# Altium project 门禁控制器V0.2.PrjPcb
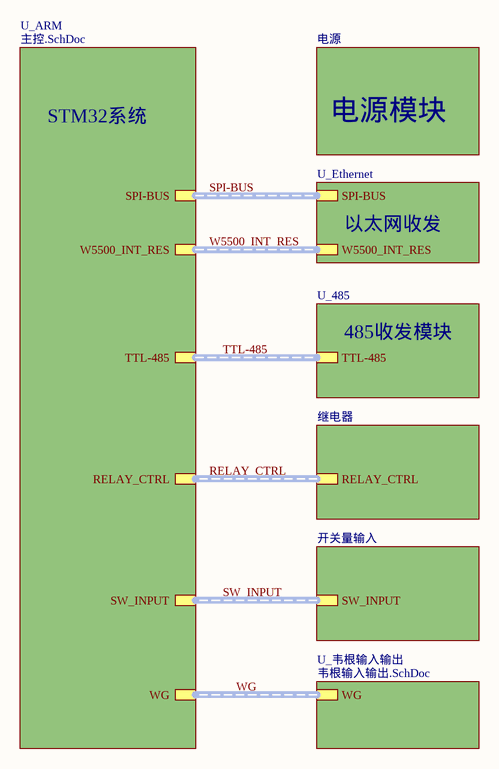
[diagram p0: 门禁控制器顶层设计.SchDoc]
8 sheets, 191 parts. Net scope: global (net labels, ports and power ports of the same name join across sheets).
Board file: 门禁控制器V0.2.PcbDoc
Sheets:
  门禁控制器顶层设计.SchDoc
    U_ARM = 主控.SchDoc
    U_485 = 485.SchDoc
    电源 = 电源.SchDoc
    U_Ethernet = TCP_IP.SchDoc
    继电器 = 继电器.SchDoc
    开关量输入 = 开关量输入.SchDoc
    U_韦根输入输出 = 韦根输入输出.SchDoc

## Sheet 门禁控制器顶层设计.SchDoc
size A4

### Sub-sheets
U_485 = 485.SchDoc: TTL-485 (harness TTL转485)
U_ARM = 主控.SchDoc: SPI-BUS (harness SPI总线), W5500_INT_RES (harness W5500_INT_RES), TTL-485 (harness TTL转485), RELAY_CTRL, SW_INPUT, WG
U_Ethernet = TCP_IP.SchDoc: SPI-BUS, W5500_INT_RES
U_韦根输入输出 = 韦根输入输出.SchDoc: WG (harness 韦根)
开关量输入 = 开关量输入.SchDoc: SW_INPUT (harness TTL转485)
电源 = 电源.SchDoc: no entries
继电器 = 继电器.SchDoc: RELAY_CTRL (harness TTL转485)

### Buses and harness runs
harness RELAY_CTRL = sheet U_ARM/RELAY_CTRL = sheet 继电器/RELAY_CTRL
harness SPI-BUS = sheet U_ARM/SPI-BUS = sheet U_Ethernet/SPI-BUS
harness SW_INPUT = sheet U_ARM/SW_INPUT = sheet 开关量输入/SW_INPUT
harness TTL-485 = sheet U_485/TTL-485 = sheet U_ARM/TTL-485
harness W5500_INT_RES = sheet U_ARM/W5500_INT_RES = sheet U_Ethernet/W5500_INT_RES
harness WG = sheet U_ARM/WG = sheet U_韦根输入输出/WG

### Notes on the sheet
- STM32系统
- 电源模块
- 以太网收发
- 485收发模块

## Sheet 主控.SchDoc
size A3
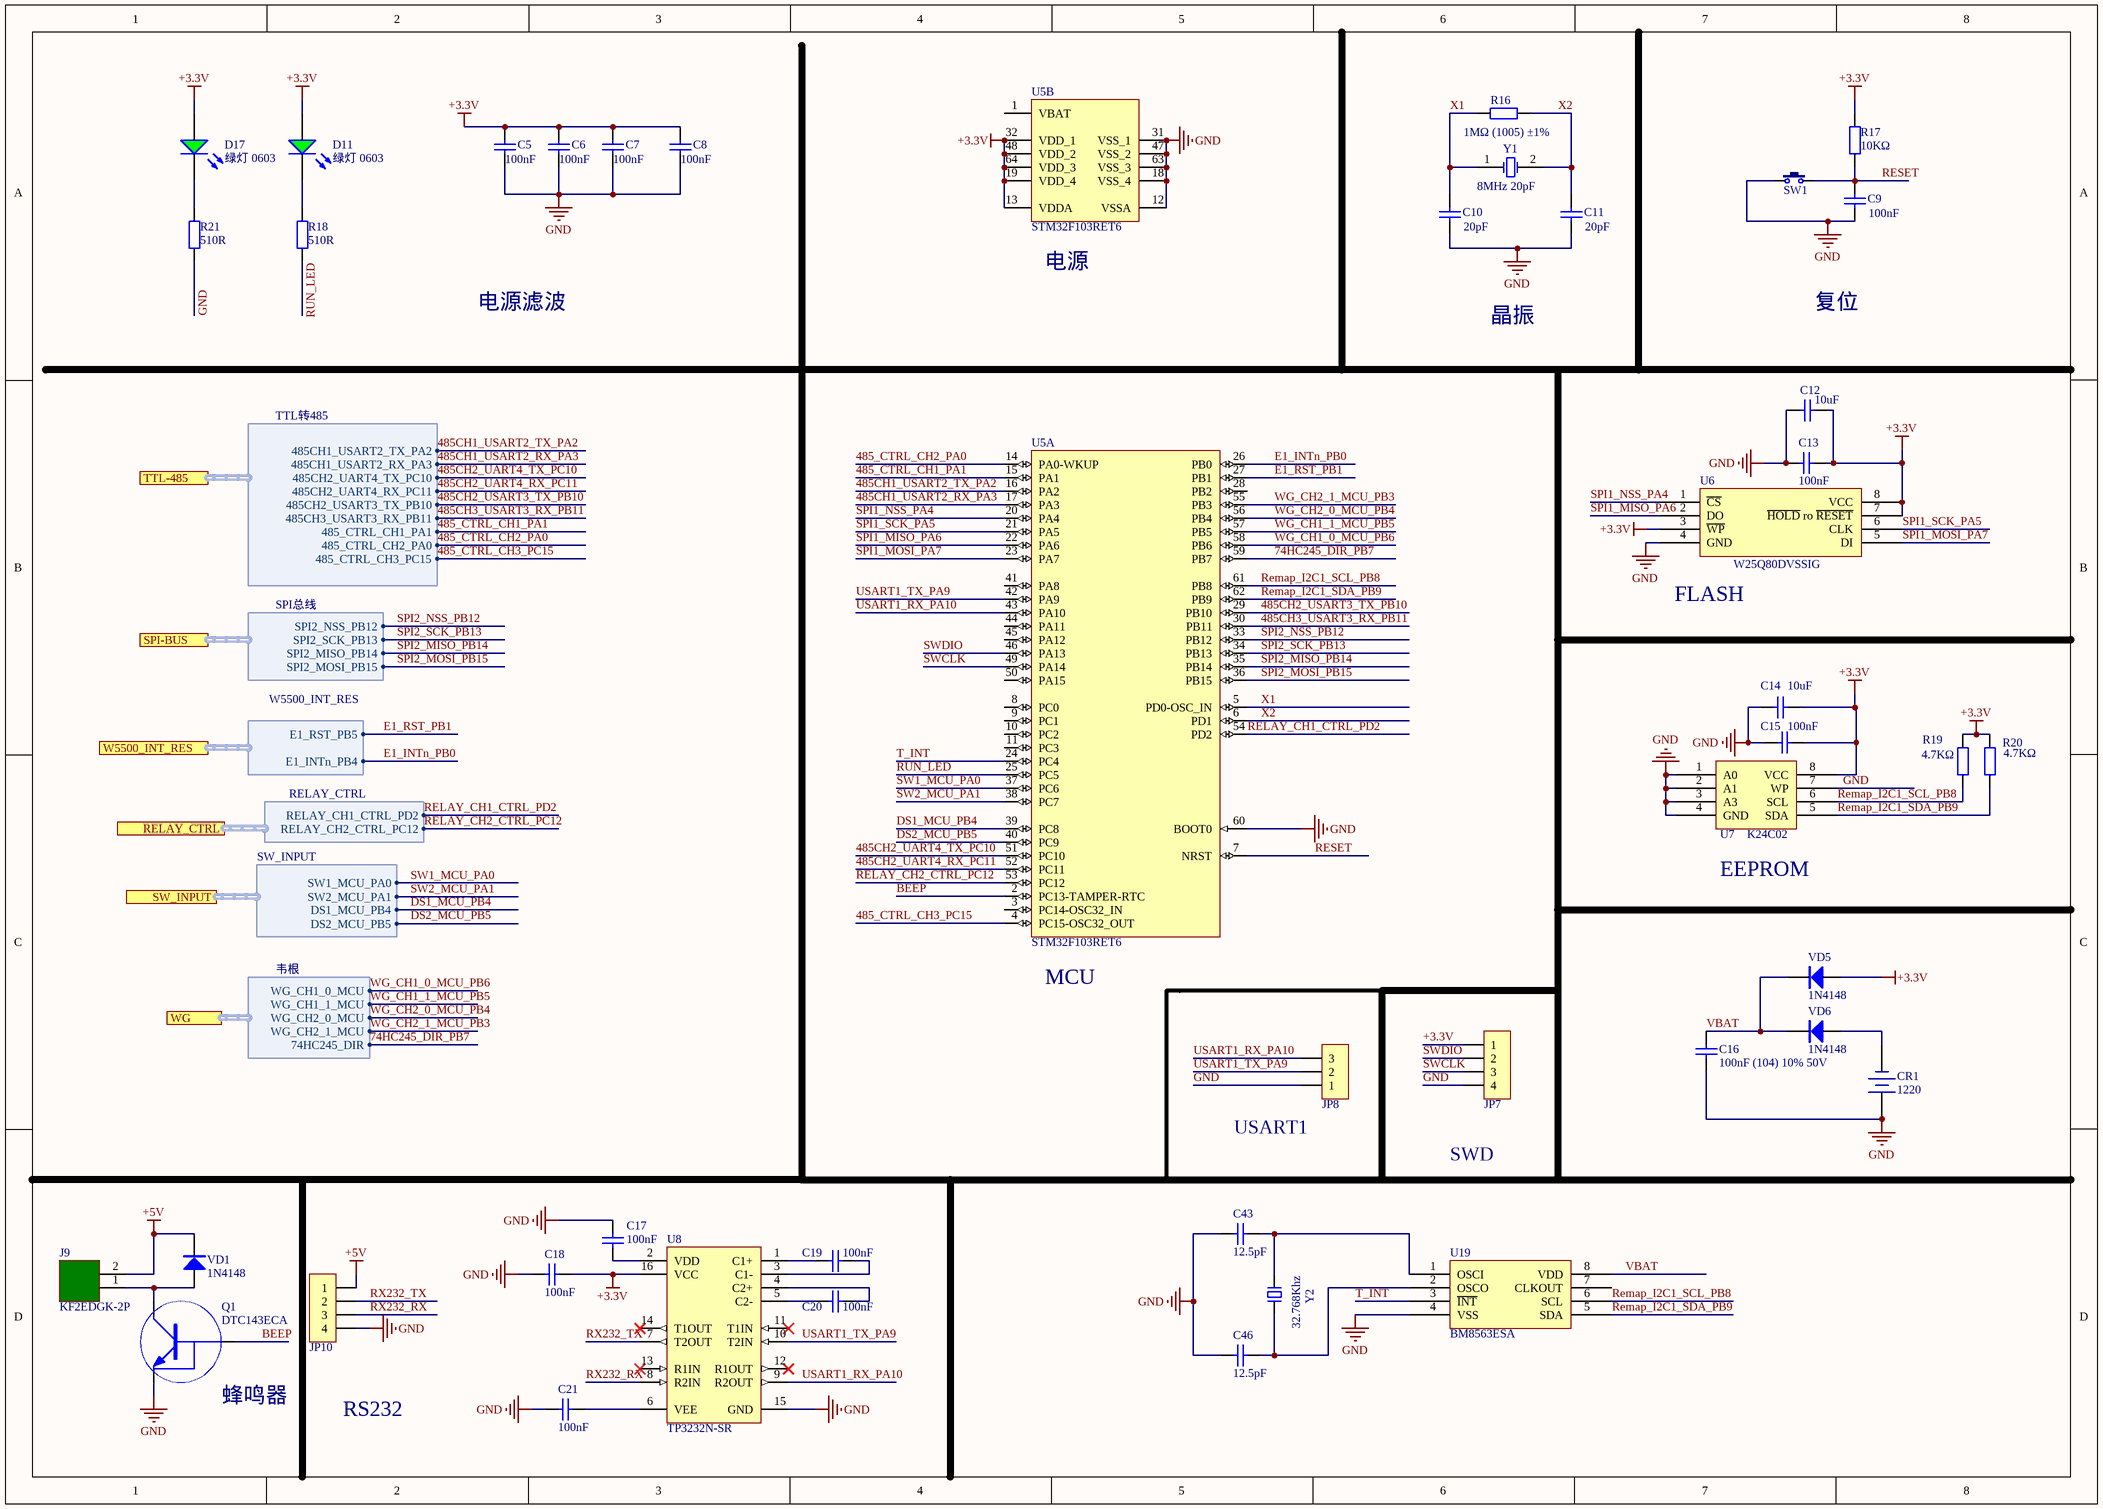
[diagram p1: 主控.SchDoc]

### Parts
C5  100nF  [0603_C]
C6  100nF  [0603_C]
C7  100nF  [0603_C]
C8  100nF  [0603_C]
C9  100nF  [0603_C]
C10  20pF  [0603_C]
C11  20pF  [0603_C]
C12  10uF  [0603_C]
C13  100nF  [0603_C]
C14  10uF  [0603_C]
C15  100nF  [0603_C]
C16  100nF (104) 10% 50V  [0603_C]
C17  100nF  [0603_C]
C18  100nF  [0603_C]
C19  100nF  [0603_C]
C20  100nF  [0603_C]
C21  100nF  [0603_C]
C43  12.5pF  [0603_C]
C46  12.5pF  [0603_C]
CR1  1220  [CR1220_A]
D11  绿灯 0603  [0603_LED_S1]
D17  绿灯 0603  [0603_LED_S1]
J9  KF2EDGK-2P  [KF2EDGK5.08W-2P]
JP7  HDR-1X4  [HDR-1X4_H]  (value not drawn)
JP8  HDR-1X3  [HDR-1X3_H]  (value not drawn)
JP10  HDR-1X4  [HDR-1X4]  (value not drawn)
Q1  DTC143ECA
R16  1MΩ (1005) ±1%  [0603_R]
R17  10KΩ  [0603_R]
R18  510R  [0603_R]
R19  4.7KΩ  [0603_R]
R20  4.7KΩ  [0603_R]
R21  510R  [0603_R]
SW1  3x6x5  [TSW SMD-3*6*4.3]  (value not drawn)
U5  STM32F103RET6  [LQFP-64_10x10x05P]  (parts A,B of 2)
U6  W25Q80DVSSIG  [SOIC-8_208mil]
U7  K24C02  [SOIC-8_150mil]
U8  TP3232N-SR  [SOIC-16_150mil]
U19  BM8563ESA  [SOIC-8_150mil]
VD1  1N4148  [MINI_MELF (LL34)]
VD5  1N4148  [MINI_MELF (LL34)]
VD6  1N4148  [MINI_MELF (LL34)]
Y1  8MHz 20pF  [XTAL-49S DIP]
Y2  32.768Khz  [XTAL-3215]

### Ports
RELAY_CTRL (harness RELAY_CTRL), SPI-BUS (harness SPI总线), SW_INPUT (harness SW_INPUT), TTL-485 (harness TTL转485), W5500_INT_RES (harness W5500_INT_RES), WG (harness 韦根)

### Harnesses
TTL转485: 485CH1_USART2_TX_PA2, 485CH1_USART2_RX_PA3, 485CH2_UART4_TX_PC10, 485CH2_UART4_RX_PC11, 485CH2_USART3_TX_PB10, 485CH3_USART3_RX_PB11, 485_CTRL_CH1_PA1, 485_CTRL_CH2_PA0, 485_CTRL_CH3_PC15
SPI总线: SPI2_NSS_PB12, SPI2_SCK_PB13, SPI2_MISO_PB14, SPI2_MOSI_PB15
W5500_INT_RES: E1_RST_PB5, E1_INTn_PB4
RELAY_CTRL: RELAY_CH1_CTRL_PD2, RELAY_CH2_CTRL_PC12
SW_INPUT: SW1_MCU_PA0, SW2_MCU_PA1, DS1_MCU_PB4, DS2_MCU_PB5
韦根: WG_CH1_0_MCU, WG_CH1_1_MCU, WG_CH2_1_MCU, 74HC245_DIR, WG_CH2_0_MCU

### Nets
+3.3V: C5.2 C6.2 C7.2 C8.2 C12.2 C13.1 C14.2 C15.1 C18.2 D11.A D17.A JP7.1 R17.1 R19.2 R20.2 U5.13(VDDA) U5.19(VDD_4) U5.32(VDD_1) U5.48(VDD_2) U5.64(VDD_3) U6.3(~{WP}) U6.7(~{HOLD}_ro_~{RESET}) U6.8(VCC) U7.8(VCC) U8.16(VCC) VD5.1(A)
+5V: J9.2 JP10.1 VD1.2(K)
GND: C5.1 C6.1 C7.1 C8.1 C9.1 C10.1 C11.1 C12.1 C13.2 C14.1 C15.2 C16.1 C17.2 C18.1 C21.1 C43.1 C46.1 CR1.1(DC+) JP7.4 JP8.1 JP10.4 Q1.2(GND) R21.1 SW1.1 U5.12(VSSA) U5.18(VSS_4) U5.31(VSS_1) U5.47(VSS_2) U5.60(BOOT0) U5.63(VSS_3) U6.4(GND) U7.1(A0) U7.2(A1) U7.3(A3) U7.4(GND) U7.7(WP) U8.15(GND) U19.4(VSS)
74HC245_DIR_PB7: U5.59(PB7) ; port WG.74HC245_DIR
485_CTRL_CH1_PA1: U5.15(PA1) ; port TTL-485.485_CTRL_CH1_PA1
485_CTRL_CH2_PA0: U5.14(PA0-WKUP) ; port TTL-485.485_CTRL_CH2_PA0
485_CTRL_CH3_PC15: U5.4(PC15-OSC32_OUT) ; port TTL-485.485_CTRL_CH3_PC15
485CH1_USART2_RX_PA3: U5.17(PA3) ; port TTL-485.485CH1_USART2_RX_PA3
485CH1_USART2_TX_PA2: U5.16(PA2) ; port TTL-485.485CH1_USART2_TX_PA2
485CH2_UART4_RX_PC11: U5.52(PC11) ; port TTL-485.485CH2_UART4_RX_PC11
485CH2_UART4_TX_PC10: U5.51(PC10) ; port TTL-485.485CH2_UART4_TX_PC10
485CH2_USART3_TX_PB10: U5.29(PB10) ; port TTL-485.485CH2_USART3_TX_PB10
485CH3_USART3_RX_PB11: U5.30(PB11) ; port TTL-485.485CH3_USART3_RX_PB11
BEEP: Q1.1(IN) U5.2(PC13-TAMPER-RTC)
DS1_MCU_PB4: U5.39(PC8) ; port SW_INPUT.DS1_MCU_PB4
DS2_MCU_PB5: U5.40(PC9) ; port SW_INPUT.DS2_MCU_PB5
E1_INTn_PB0: U5.26(PB0) ; port W5500_INT_RES.E1_INTn_PB4
E1_RST_PB1: U5.27(PB1) ; port W5500_INT_RES.E1_RST_PB5
RELAY_CH1_CTRL_PD2: U5.54(PD2) ; port RELAY_CTRL.RELAY_CH1_CTRL_PD2
RELAY_CH2_CTRL_PC12: U5.53(PC12) ; port RELAY_CTRL.RELAY_CH2_CTRL_PC12
Remap_I2C1_SCL_PB8: R19.1 U5.61(PB8) U7.6(SCL) U19.6(SCL)
Remap_I2C1_SDA_PB9: R20.1 U5.62(PB9) U7.5(SDA) U19.5(SDA)
RESET: C9.2 R17.2 SW1.2 U5.7(NRST)
RUN_LED: R18.1 U5.25(PC5)
RX232_RX: JP10.3 U8.8(R2IN)
RX232_TX: JP10.2 U8.7(T2OUT)
SPI1_MISO_PA6: U5.22(PA6) U6.2(DO)
SPI1_MOSI_PA7: U5.23(PA7) U6.5(DI)
SPI1_NSS_PA4: U5.20(PA4) U6.1(~{CS})
SPI1_SCK_PA5: U5.21(PA5) U6.6(CLK)
SPI2_MISO_PB14: U5.35(PB14) ; port SPI-BUS.SPI2_MISO_PB14
SPI2_MOSI_PB15: U5.36(PB15) ; port SPI-BUS.SPI2_MOSI_PB15
SPI2_NSS_PB12: U5.33(PB12) ; port SPI-BUS.SPI2_NSS_PB12
SPI2_SCK_PB13: U5.34(PB13) ; port SPI-BUS.SPI2_SCK_PB13
SW1_MCU_PA0: U5.37(PC6) ; port SW_INPUT.SW1_MCU_PA0
SW2_MCU_PA1: U5.38(PC7) ; port SW_INPUT.SW2_MCU_PA1
SWCLK: JP7.3 U5.49(PA14)
SWDIO: JP7.2 U5.46(PA13)
T_INT: U5.24(PC4) U19.3(~{INT})
USART1_RX_PA10: JP8.3 U5.43(PA10) U8.9(R2OUT)
USART1_TX_PA9: JP8.2 U5.42(PA9) U8.10(T2IN)
VBAT: C16.2 U19.8(VDD) VD5.2(K) VD6.2(K)
WG_CH1_0_MCU_PB6: U5.58(PB6) ; port WG.WG_CH1_0_MCU
WG_CH1_1_MCU_PB5: U5.57(PB5) ; port WG.WG_CH1_1_MCU
WG_CH2_0_MCU_PB4: U5.56(PB4) ; port WG.WG_CH2_0_MCU
WG_CH2_1_MCU_PB3: U5.55(PB3) ; port WG.WG_CH2_1_MCU
X1: C10.2 R16.1 U5.5(PD0-OSC_IN) Y1.1(OSC1)
X2: C11.2 R16.2 U5.6(PD1) Y1.2(OSC2)
NetC17_1: C17.1 U8.2(VDD)
NetC19_1: C19.1 U8.1(C1+)
NetC19_2: C19.2 U8.3(C1-)
NetC20_1: C20.1 U8.5(C2-)
NetC20_2: C20.2 U8.4(C2+)
NetC21_2: C21.2 U8.6(VEE)
NetC43_2: C43.2 U19.1(OSCI) Y2.1
NetC46_2: C46.2 U19.2(OSCO) Y2.2
NetCR1_2: CR1.2(DC-) VD6.1(A)
NetD11_K: D11.K R18.2
NetD17_K: D17.K R21.2
NetJ9_1: J9.1 Q1.3(OUT) VD1.1(A)

Not connected (* = marked no-connect by the designer): U5 1(VBAT) 3(PC14-OSC32_IN) 8(PC0) 9(PC1) 10(PC2) 11(PC3) 28(PB2) 41(PA8) 44(PA11) 45(PA12) 50(PA15); U8 11(T1IN)* 12(R1OUT)* 13(R1IN)* 14(T1OUT)*; U19 7(CLKOUT)

### Notes on the sheet
- 电源滤波
- (near U5) 电源
- 复位
- 晶振
- (near U6) FLASH
- (near U7) EEPROM
- (near U5) MCU
- (near JP8) USART1
- SWD
- (near Q1) 蜂鸣器
- RS232
- Labels drawn without touching a wire or pin: DS2_MCU_PB5, SW1_MCU_PA0

### Library data of the parts
C5-C9 C13 C15-C21 = 0603 100nF (104) 10% 50V: 贴片电容; ComponentLink1Description: 供应商链接; ComponentLink1URL: http://www.szlcsc.com/product/details_15331.html; Package: 0603; Supplier: LC; SuppliersPartNumber: C14663
C10 C11 = 0603 6pF (6R0) 0.25pF 50V: 贴片电容; ComponentLink1Description: 供应商链接; ComponentLink1URL: http://www.szlcsc.com/product/details_38453.html; Package: 0603; Supplier: LC; SuppliersPartNumber: C37474
C12 C14 = 0603 10uF (106) 10% 10V: 贴片电容; ComponentLink1Description: 供应商链接; ComponentLink1URL: http://www.szlcsc.com/product/details_20411.html; Package: 0603; Supplier: LC; SuppliersPartNumber: C19702
C43 C46 = 0603 12pF (120) 5% 50V: 贴片电容; ComponentLink1Description: 供应商链接; ComponentLink1URL: http://www.szlcsc.com/product/details_39506.html; Package: 0603; Supplier: LC; SuppliersPartNumber: C38523
CR1 = CR-3V: 微型电池; 版权归属: 源创客; BOM名称: 微型电池; 学习资源: www.ooocke.com
D11 D17 = 0603 绿灯: 发光二极管; ComponentLink1Description: 供应商链接; ComponentLink1URL: http://www.szlcsc.com/product/details_73152.html; Package: 0603; Supplier: LC; SuppliersPartNumber: C72043
JP7 JP10 = Header 4: 4P接插件; 版权归属: 源创客; BOM名称: 4P接插件; 学习资源: www.ooocke.com
JP8 = Header 3: 3P接插件; 版权归属: 源创客; BOM名称: 3P接插件; 学习资源: www.ooocke.com
Q1 = DTC143ECA: NPN集成三极管; ComponentLink1Description: 供应商; ComponentLink1URL: https://item.szlcsc.com/14526.html
R16 = 0603 10MΩ (1005) 1%: 贴片电阻; ComponentLink1Description: 供应商链接; ComponentLink1URL: http://www.szlcsc.com/product/details_7726.html; Package: 0603; Supplier: LC; SuppliersPartNumber: C7250
R17 = 0603 10KΩ (1002) 1%: 贴片电阻; ComponentLink1Description: 供应商链接; ComponentLink1URL: http://www.szlcsc.com/product/details_26547.html; Package: 0603; Supplier: LC; SuppliersPartNumber: C25804
R18 R21 = 0603 2KΩ (2001) 1%: 贴片电阻; ComponentLink1Description: 供应商链接; ComponentLink1URL: http://www.szlcsc.com/product/details_23702.html; Package: 0603; Supplier: LC; SuppliersPartNumber: C22975
R19 R20 = 0603 4.7KΩ (4701) 1%: 贴片电阻; ComponentLink1Description: 供应商链接; ComponentLink1URL: http://www.szlcsc.com/product/details_23889.html; Package: 0603; Supplier: LC; SuppliersPartNumber: C23162
SW1 = TSW 3x6: 3x6轻触开关; 版权归属: 源创客; BOM名称: 3x6轻触开关; 学习资源: www.ooocke.com
U5 = STM32F103RET6: ARM; ComponentLink1Description: 供应商链接; ComponentLink1URL: http://www.szlcsc.com/product/details_8814.html; Package: LQFP-64_10x10x05P; Supplier: LC; SuppliersPartNumber: C8322
U6 = W25Q128FVSIG: Flash ROM; ComponentLink1Description: 供应商链接; ComponentLink1URL: http://www.szlcsc.com/product/details_36072.html; Package: SOIC-8; Supplier: LC; SuppliersPartNumber: C35101; ComponentLink2Description: 华邦; ComponentLink2URL: https://item.szlcsc.com/14743.html
U7 = EEPROM/AT24C256C-SSHL-T: EEPROM; ComponentLink1Description: 供应商链接; ComponentLink1URL: http://www.szlcsc.com/product/details_6947.html; Package: SOIC-8_150mil; Supplier: LC; SuppliersPartNumber: C6482; ComponentLink2Description: 华虹宏力; ComponentLink2URL: https://item.szlcsc.com/84948.html
U8 = MAX232ESE: RS232; ComponentLink1Description: 供应商链接; ComponentLink1URL: http://www.szlcsc.com/product/details_27608.html; Package: SOIC-16_150mil; Supplier: LC; SuppliersPartNumber: C26860
U19 = PCF8563T/5,518: 实时时钟; ComponentLink1Description: 供应商链接; ComponentLink1URL: http://www.szlcsc.com/product/details_7917.html; Package: SOIC-8_150mil; Supplier: LC; SuppliersPartNumber: C7440; ComponentLink2Description: BL(上海贝岭); ComponentLink2URL: https://item.szlcsc.com/142290.html
VD1 VD5 VD6 = 1N4148: 高速开关二极管; 版权归属: 源创客; BOM名称: 高速开关二极管; 学习资源: www.ooocke.com
Y1 = SMD-5032_2P 8MHz 20ppm 20pF: 贴片晶振; ComponentLink1Description: 供应商链接; ComponentLink1URL: http://www.szlcsc.com/product/details_19261.html; Package: SMD-5032_2P; Supplier: LC; SuppliersPartNumber: C18560
Y2 = XTAL-2: 2脚晶振; 版权归属: 源创客; BOM名称: 2脚晶振; 学习资源: www.ooocke.com

## Sheet 485.SchDoc
size A3
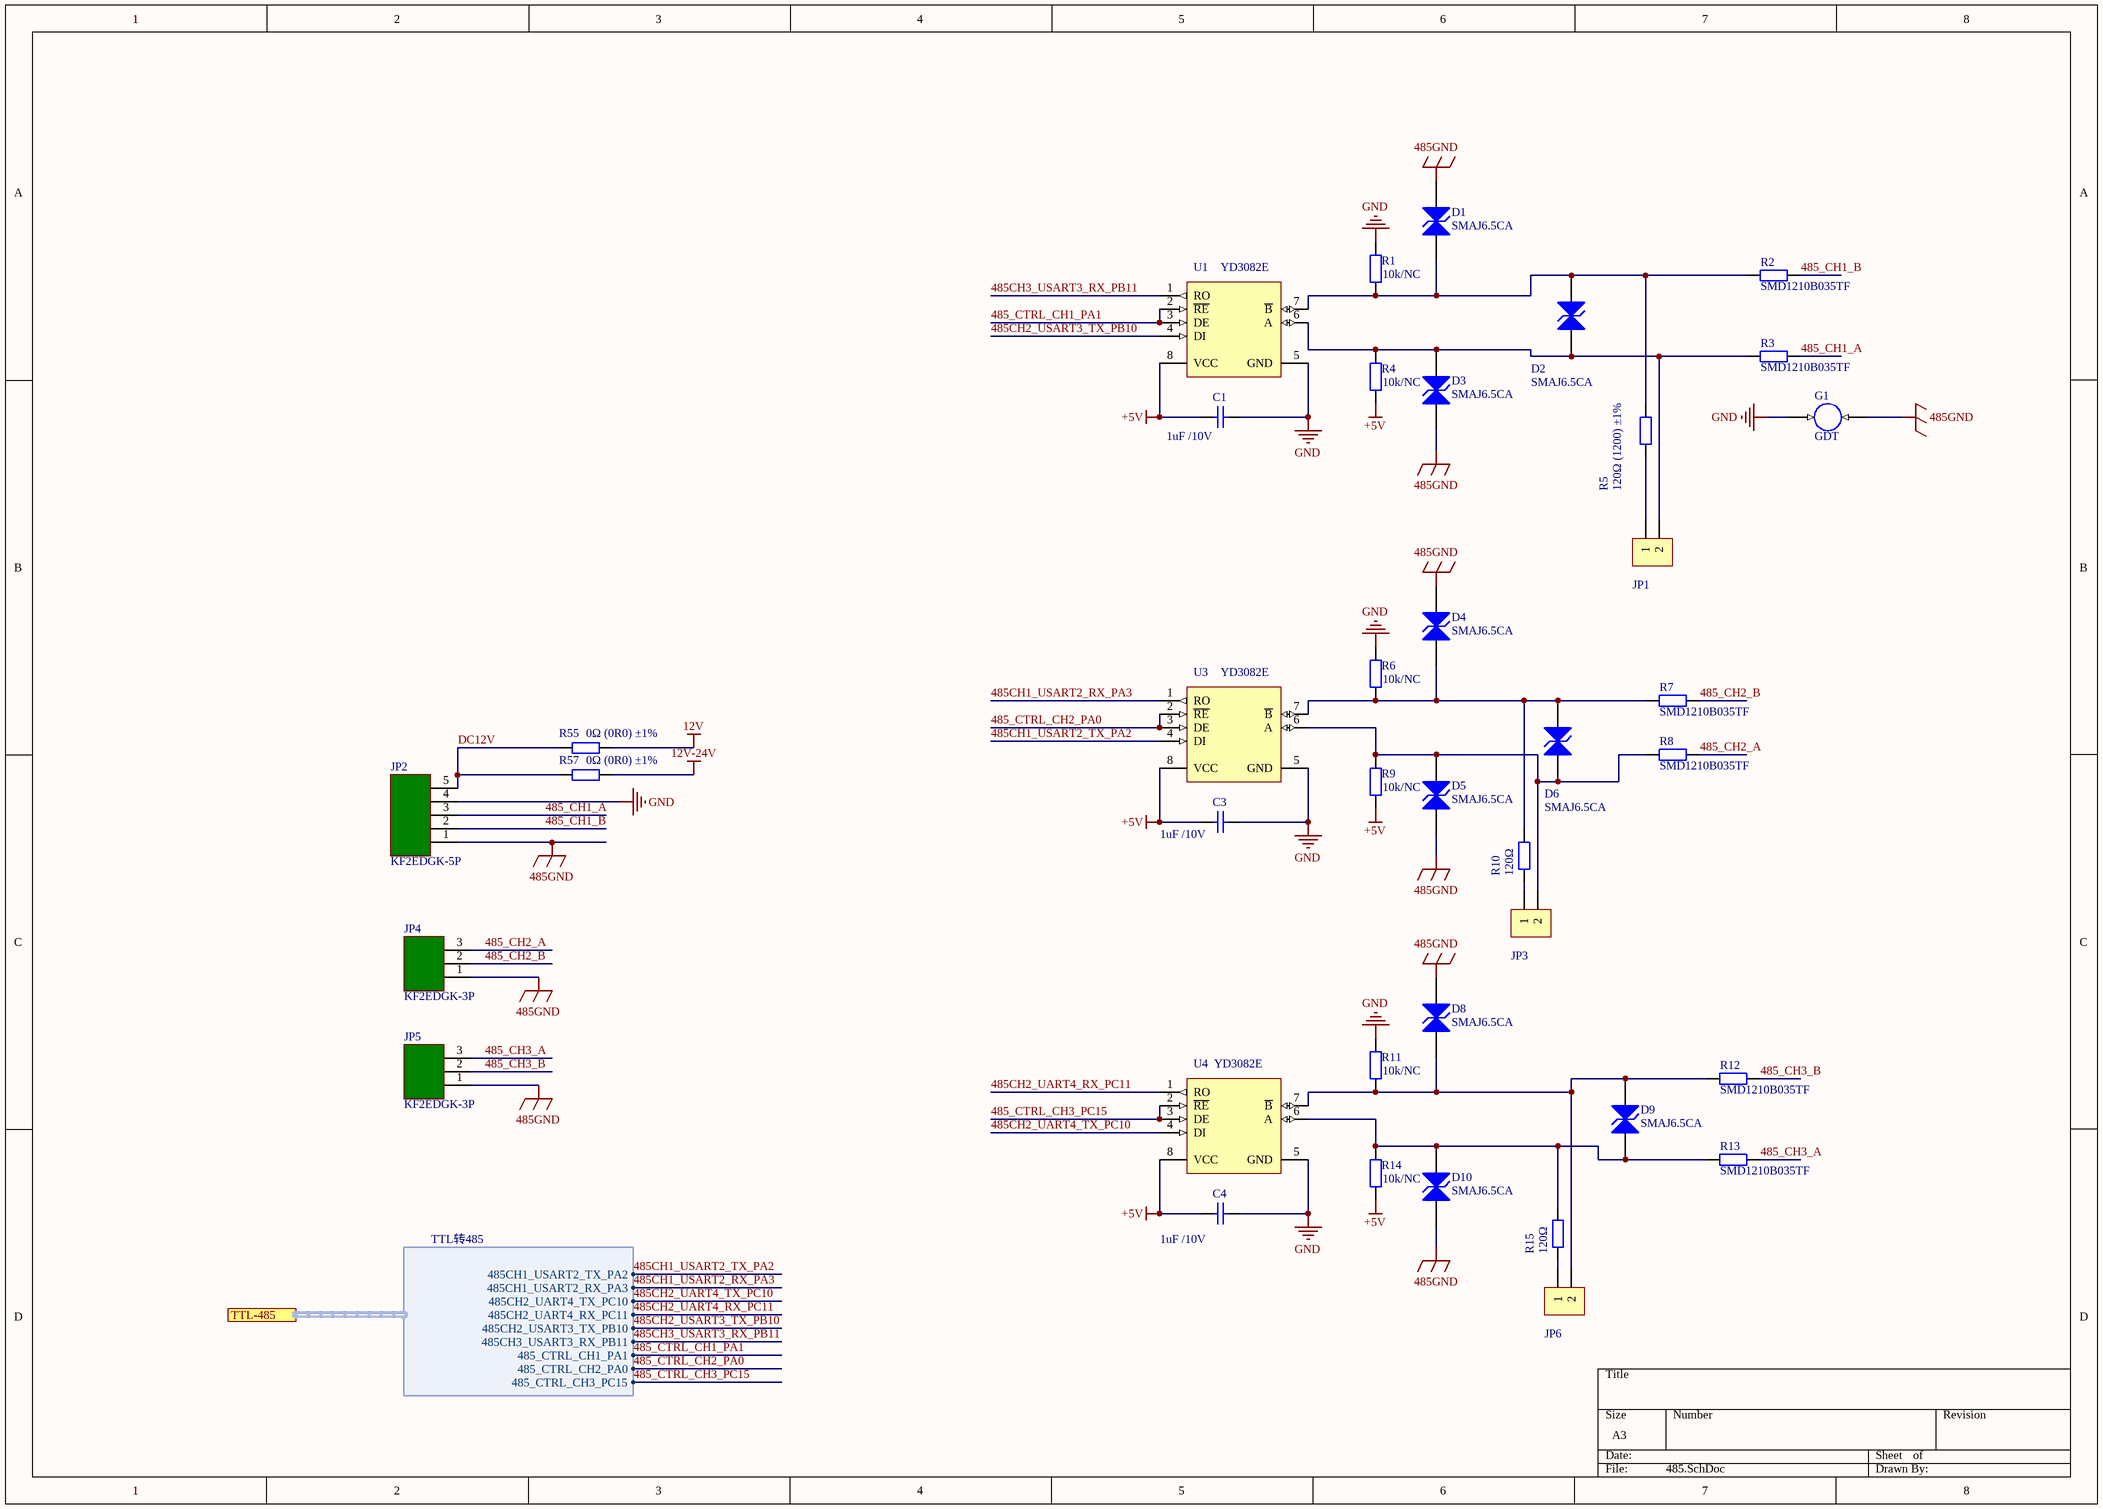
[diagram p2: 485.SchDoc]

### Parts
C1  1uF /10V  [0603_C]
C3  1uF /10V  [0603_C]
C4  1uF /10V  [0603_C]
D1  SMAJ6.5CA  [SMA(DO-214AC)_S1]
D2  SMAJ6.5CA  [SMA(DO-214AC)_S1]
D3  SMAJ6.5CA  [SMA(DO-214AC)_S1]
D4  SMAJ6.5CA  [SMA(DO-214AC)_S1]
D5  SMAJ6.5CA  [SMA(DO-214AC)_S1]
D6  SMAJ6.5CA  [SMA(DO-214AC)_S1]
D8  SMAJ6.5CA  [SMA(DO-214AC)_S1]
D9  SMAJ6.5CA  [SMA(DO-214AC)_S1]
D10  SMAJ6.5CA  [SMA(DO-214AC)_S1]
G1  GDT  [GDT]
JP1  HDR-1X2  [HDR-1X2]  (value not drawn)
JP2  KF2EDGK-5P  [KF2EDGK5.08W-5P]
JP3  HDR-1X2  [HDR-1X2]  (value not drawn)
JP4  KF2EDGK-3P  [KF2EDGK5.08W-3P]
JP5  KF2EDGK-3P  [KF2EDGK5.08W-3P]
JP6  HDR-1X2  [HDR-1X2]  (value not drawn)
R1  10k/NC  [0603_R]
R2  SMD1210B035TF  [1206_R]
R3  SMD1210B035TF  [1206_R]
R4  10k/NC  [0603_R]
R5  120Ω (1200) ±1%  [0603_R]
R6  10k/NC  [0603_R]
R7  SMD1210B035TF  [1206_R]
R8  SMD1210B035TF  [1206_R]
R9  10k/NC  [0603_R]
R10  120Ω  [0603_R]
R11  10k/NC  [0603_R]
R12  SMD1210B035TF  [1206_R]
R13  SMD1210B035TF  [1206_R]
R14  10k/NC  [0603_R]
R15  120Ω  [0603_R]
R55  0Ω (0R0) ±1%  [1206_R]
R57  0Ω (0R0) ±1%  [1206_R]
U1  YD3082E  [SOIC-8_150mil]
U3  YD3082E  [SOIC-8_150mil]
U4  YD3082E  [SOIC-8_150mil]

### Ports
TTL-485 (harness TTL转485)

### Harnesses
TTL转485: 485CH1_USART2_TX_PA2, 485CH1_USART2_RX_PA3, 485CH2_UART4_TX_PC10, 485CH2_UART4_RX_PC11, 485CH2_USART3_TX_PB10, 485CH3_USART3_RX_PB11, 485_CTRL_CH1_PA1, 485_CTRL_CH2_PA0, 485_CTRL_CH3_PC15

### Nets
12V: R55.1
12V-24V: R57.1
485GND: D1.1(A) D3.1(A) D4.1(A) D5.1(A) D8.1(A) D10.1(A) G1.1 JP2.1 JP4.1 JP5.1
+5V: C1.1 C3.1 C4.1 R4.1 R9.1 R14.1 U1.8(VCC) U3.8(VCC) U4.8(VCC)
GND: C1.2 C3.2 C4.2 G1.2 JP2.4 R1.2 R6.2 R11.2 U1.5(GND) U3.5(GND) U4.5(GND)
485_CH1_A: JP2.3 R3.2
485_CH1_B: JP2.2 R2.2
485_CH2_A: JP4.3 R8.2
485_CH2_B: JP4.2 R7.2
485_CH3_A: JP5.3 R13.2
485_CH3_B: JP5.2 R12.2
485_CTRL_CH1_PA1: U1.2(~{RE}) U1.3(DE) ; port TTL-485.485_CTRL_CH1_PA1
485_CTRL_CH2_PA0: U3.2(~{RE}) U3.3(DE) ; port TTL-485.485_CTRL_CH2_PA0
485_CTRL_CH3_PC15: U4.2(~{RE}) U4.3(DE) ; port TTL-485.485_CTRL_CH3_PC15
485CH1_USART2_RX_PA3: U3.1(RO) ; port TTL-485.485CH1_USART2_RX_PA3
485CH1_USART2_TX_PA2: U3.4(DI) ; port TTL-485.485CH1_USART2_TX_PA2
485CH2_UART4_RX_PC11: U4.1(RO) ; port TTL-485.485CH2_UART4_RX_PC11
485CH2_UART4_TX_PC10: U4.4(DI) ; port TTL-485.485CH2_UART4_TX_PC10
485CH2_USART3_TX_PB10: U1.4(DI) ; port TTL-485.485CH2_USART3_TX_PB10
485CH3_USART3_RX_PB11: U1.1(RO) ; port TTL-485.485CH3_USART3_RX_PB11
DC12V: JP2.5 R55.2 R57.2
NetD1_2: D1.2(K) D2.1(A) R1.1 R2.1 R5.1 U1.7(~{B})
NetD2_2: D2.2(K) D3.2(K) JP1.2 R3.1 R4.2 U1.6(A)
NetD4_2: D4.2(K) D6.1(A) R6.1 R7.1 R10.2 U3.7(~{B})
NetD5_2: D5.2(K) D6.2(K) JP3.2 R8.1 R9.2 U3.6(A)
NetD8_2: D8.2(K) D9.1(A) JP6.2 R11.1 R12.1 U4.7(~{B})
NetD9_2: D9.2(K) D10.2(K) R13.1 R14.2 R15.2 U4.6(A)
NetJP1_1: JP1.1 R5.2
NetJP3_1: JP3.1 R10.1
NetJP6_1: JP6.1 R15.1

### Library data of the parts
C1 C3 C4 = 0603 100nF (104) 10% 50V: 贴片电容; ComponentLink1Description: 供应商链接; ComponentLink1URL: http://www.szlcsc.com/product/details_15331.html; Package: 0603; Supplier: LC; SuppliersPartNumber: C14663
D1-D6 D8-D10 = SMB/DO-214AA P6SMB6.8CA: TVS; ComponentLink1Description: 供应商链接; ComponentLink1URL: http://www.szlcsc.com/product/details_79530.html; Package: SMB/DO-214AA; Supplier: LC; SuppliersPartNumber: C78395
G1 = GDT: 放电管
JP1 JP3 JP6 = Header 2: 2P接插件; 版权归属: 源创客; BOM名称: 2P接插件; 学习资源: www.ooocke.com
R1 R4 R6 R9 R11 R14 = 0603 3.3KΩ (3301) 1%: 贴片电阻; ComponentLink1Description: 供应商链接; ComponentLink1URL: http://www.szlcsc.com/product/details_23705.html; Package: 0603; Supplier: LC; SuppliersPartNumber: C22978
R2 R3 R7 R8 R12 R13 R55 R57 = 1206 0Ω (0R0) 1%: 贴片电阻; ComponentLink1Description: 供应商链接; ComponentLink1URL: http://www.szlcsc.com/product/details_18576.html; Package: 1206; Supplier: LC; SuppliersPartNumber: C17888
R5 R10 R15 = 0603 120Ω (1200) 1%: 贴片电阻; ComponentLink1Description: 供应商链接; ComponentLink1URL: http://www.szlcsc.com/product/details_23514.html; Package: 0603; Supplier: LC; SuppliersPartNumber: C22787
U1 U3 U4 = SP485EEN-L/TR: RS-485/RS-422; ComponentLink1Description: 供应商链接; ComponentLink1URL: http://www.szlcsc.com/product/details_7327.html; Package: SOIC-8; Supplier: LC; SuppliersPartNumber: C6855

## Sheet 电源.SchDoc
size A4
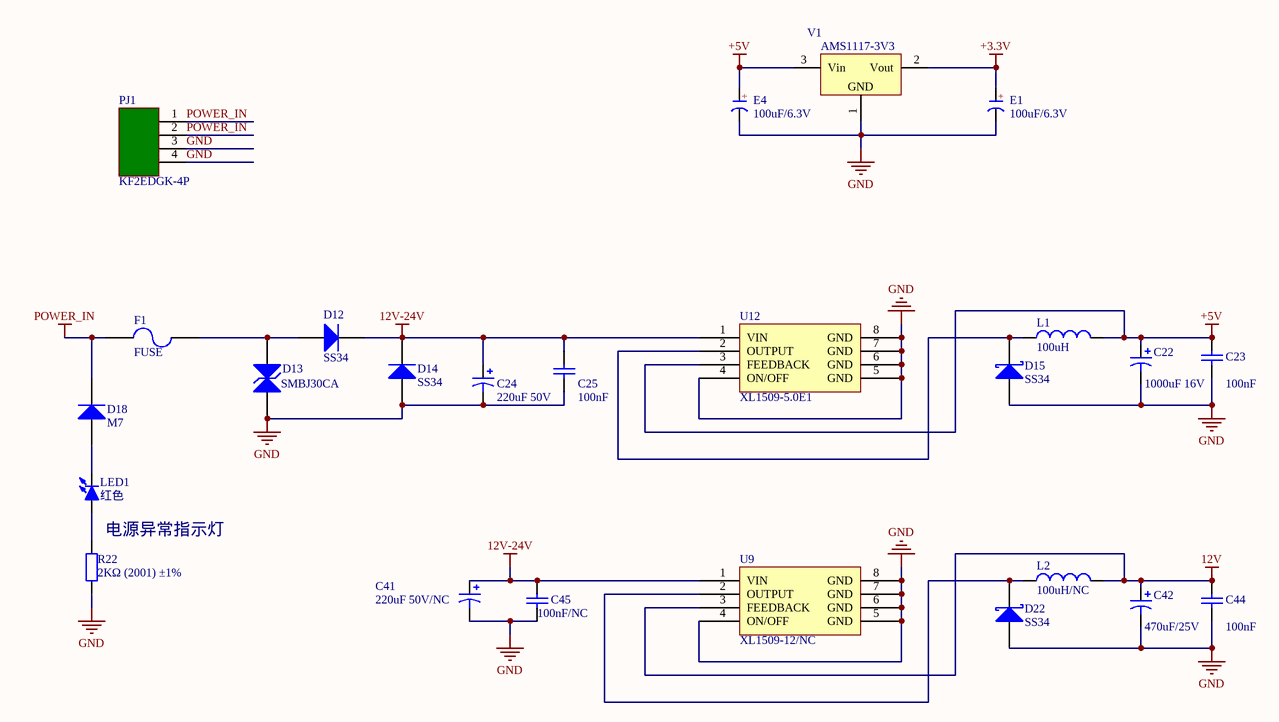
[diagram p3: 电源.SchDoc]

### Parts
C22  value 1000uF 16V  [CAP 5.0*10*12.5]  (hidden comment: Cap Pol1)
C23  value 100nF  [1206_c]  (hidden comment: Cap Semi)
C24  value 220uF 50V  [CAP 5.0*10*12.5]  (hidden comment: Cap Pol1)
C25  100nF  [1206_c]
C41  value 220uF 50V/NC  [CAP 5.0*10*12.5]  (hidden comment: Cap Pol1)
C42  value 470uF/25V  [CAP 5.0*10*12.5]  (hidden comment: Cap Pol1)
C44  value 100nF  [1206_c]  (hidden comment: Cap Semi)
C45  100nF/NC  [1206_c]
D12  SS34  [SMA(DO-214AC)_S1]
D13  SMBJ30CA  [SMB(DO-214AA)_S1]
D14  SS34  [SMA(DO-214AC)_S1]
D15  SS34  [SMA(DO-214AC)_S1]
D18  M7  [SMA(DO-214AC)_S1]
D22  SS34  [SMA(DO-214AC)_S1]
E1  100uF/6.3V  [CM C(5*5.4)]
E4  100uF/6.3V  [CM C(5*5.4)]
F1  FUSE  [FUSE-RAD0.2]
L1  value 100uH  [CD75]  (hidden comment: Inductor)
L2  value 100uH/NC  [CD75]  (hidden comment: Inductor)
LED1  红色  [LED 1206R]
PJ1  KF2EDGK-4P  [KF2EDGK5.08W-4P]
R22  2KΩ (2001) ±1%  [1206_R]
U9  XL1509-12/NC  [SOP-8_150mil]
U12  XL1509-5.0E1  [SOP-8_150mil]
V1  AMS1117-3V3  [SOT223_L]

### Nets
12V: C42.1 C44.2 L2.2 U9.3(FEEDBACK)
12V-24V: C24.1 C25.2 C41.1 C45.2 D12.2(K) D14.2(K) U9.1(VIN) U12.1(VIN)
+3.3V: E1.1(A) V1.2(Vout)
+5V: C22.1 C23.2 E4.1(A) L1.2 U12.3(FEEDBACK) V1.3(Vin)
GND: C22.2 C23.1 C24.2 C25.1 C41.2 C42.2 C44.1 C45.1 D13.1(A) D14.1(A) D15.1(A) D22.1(A) E1.2(K) E4.2(K) PJ1.3 PJ1.4 R22.1 U9.4(ON/OFF) U9.5(GND) U9.6(GND) U9.7(GND) U9.8(GND) U12.4(ON/OFF) U12.5(GND) U12.6(GND) U12.7(GND) U12.8(GND) V1.1(GND)
POWER_IN: D18.2(K) F1.1 PJ1.1 PJ1.2
NetD12_1: D12.1(A) D13.2(K) F1.2
NetD15_2: D15.2(K) L1.1 U12.2(OUTPUT)
NetD18_1: D18.1(A) LED1.2(K)
NetD22_2: D22.2(K) L2.1 U9.2(OUTPUT)
NetLED1_1: LED1.1(A) R22.2

### Notes on the sheet
- 电源异常指示灯
- (in symbol C-CM) +

### Library data of the parts
C22 C24 C41 C42 = Cap Pol1: Polarized Capacitor (Radial); Published: 8-Jun-2000; LatestRevisionDate: 17-Jul-2002; LatestRevisionNote: Re-released for DXP Platform.; PackageReference: RB7.6-15; Publisher: Altium Limited
  C24 C41: PackageDescription: Polarized Capacitor (Radial); 2 Leads
C23 C44 = Cap Semi: Capacitor (Semiconductor SIM Model); Published: 8-Jun-2000; LatestRevisionDate: 29-May-2009; LatestRevisionNote: IPC-7351 Footprint Added.; PackageReference: C1206; Publisher: Altium Limited; PackageDescription: Chip Capacitor
C25 C45 = 0603 100nF (104) 10% 50V: 贴片电容; ComponentLink1Description: 供应商链接; ComponentLink1URL: http://www.szlcsc.com/product/details_15331.html; Package: 0603; Supplier: LC; SuppliersPartNumber: C14663
D12 D14 = SMA(DO-214AC) SS54: 二极管; ComponentLink1Description: 供应商链接; ComponentLink1URL: http://www.szlcsc.com/product/details_23178.html; Package: SMA(DO-214AC); Supplier: LC; SuppliersPartNumber: C22452
D13 = SMB/DO-214AA P6SMB6.8CA: TVS; ComponentLink1Description: 供应商链接; ComponentLink1URL: http://www.szlcsc.com/product/details_79530.html; Package: SMB/DO-214AA; Supplier: LC; SuppliersPartNumber: C78395
D15 D22 = D Schottky: Schottky Diode; Published: 8-Jun-2000; LatestRevisionDate: 17-Jul-2002; LatestRevisionNote: Re-released for DXP Platform.; PackageReference: SMB; Publisher: Altium Limited; Code_JEDEC: DO-214-AA
D18 = SMA(DO-214AC) M7: 二极管; 备注: 1N4007 4007 编号C2464 已经停售, 使用新物料编号C95872; ComponentLink1Description: 供应商链接; ComponentLink1URL: http://www.szlcsc.com/product/details_2841.html; Package: SMA(DO-214AC); Supplier: LC; SuppliersPartNumber: C95872
E1 E4 = C-CM: 贴片电解电容; 版权归属: 源创客; BOM名称: 贴片电解电容; 学习资源: www.ooocke.com
L1 L2 = Inductor: Code_IEC: 1005; Published: 8-Jun-2000; LatestRevisionDate: 29-May-2009; LatestRevisionNote: IPC-7351 Footprint Added.; PackageReference: 0402-A; Publisher: Altium Limited; PackageDescription: Chip Inductor; Code_JEITA: 0402
LED1 = LED-SMD: 贴片LED; 版权归属: 源创客; BOM名称: 贴片LED; 学习资源: www.ooocke.com
R22 = 1206 2KΩ (2001) 1%: 贴片电阻; ComponentLink1Description: 供应商链接; ComponentLink1URL: http://www.szlcsc.com/product/details_18632.html; Package: 1206; Supplier: LC; SuppliersPartNumber: C17944
U9 U12 = XL1509-5.0E1: DC-DC芯片; ComponentLink1Description: 供应商链接; ComponentLink1URL: http://www.szlcsc.com/product/details_62115.html; Package: SOP-8_150mil; Supplier: LC; SuppliersPartNumber: C61063
V1 = AMS1117: 三端稳压芯片; BOM名称: 稳压芯片; 版权归属: 源创客; 学习资源: www.ooocke.com

## Sheet TCP_IP.SchDoc
size A3
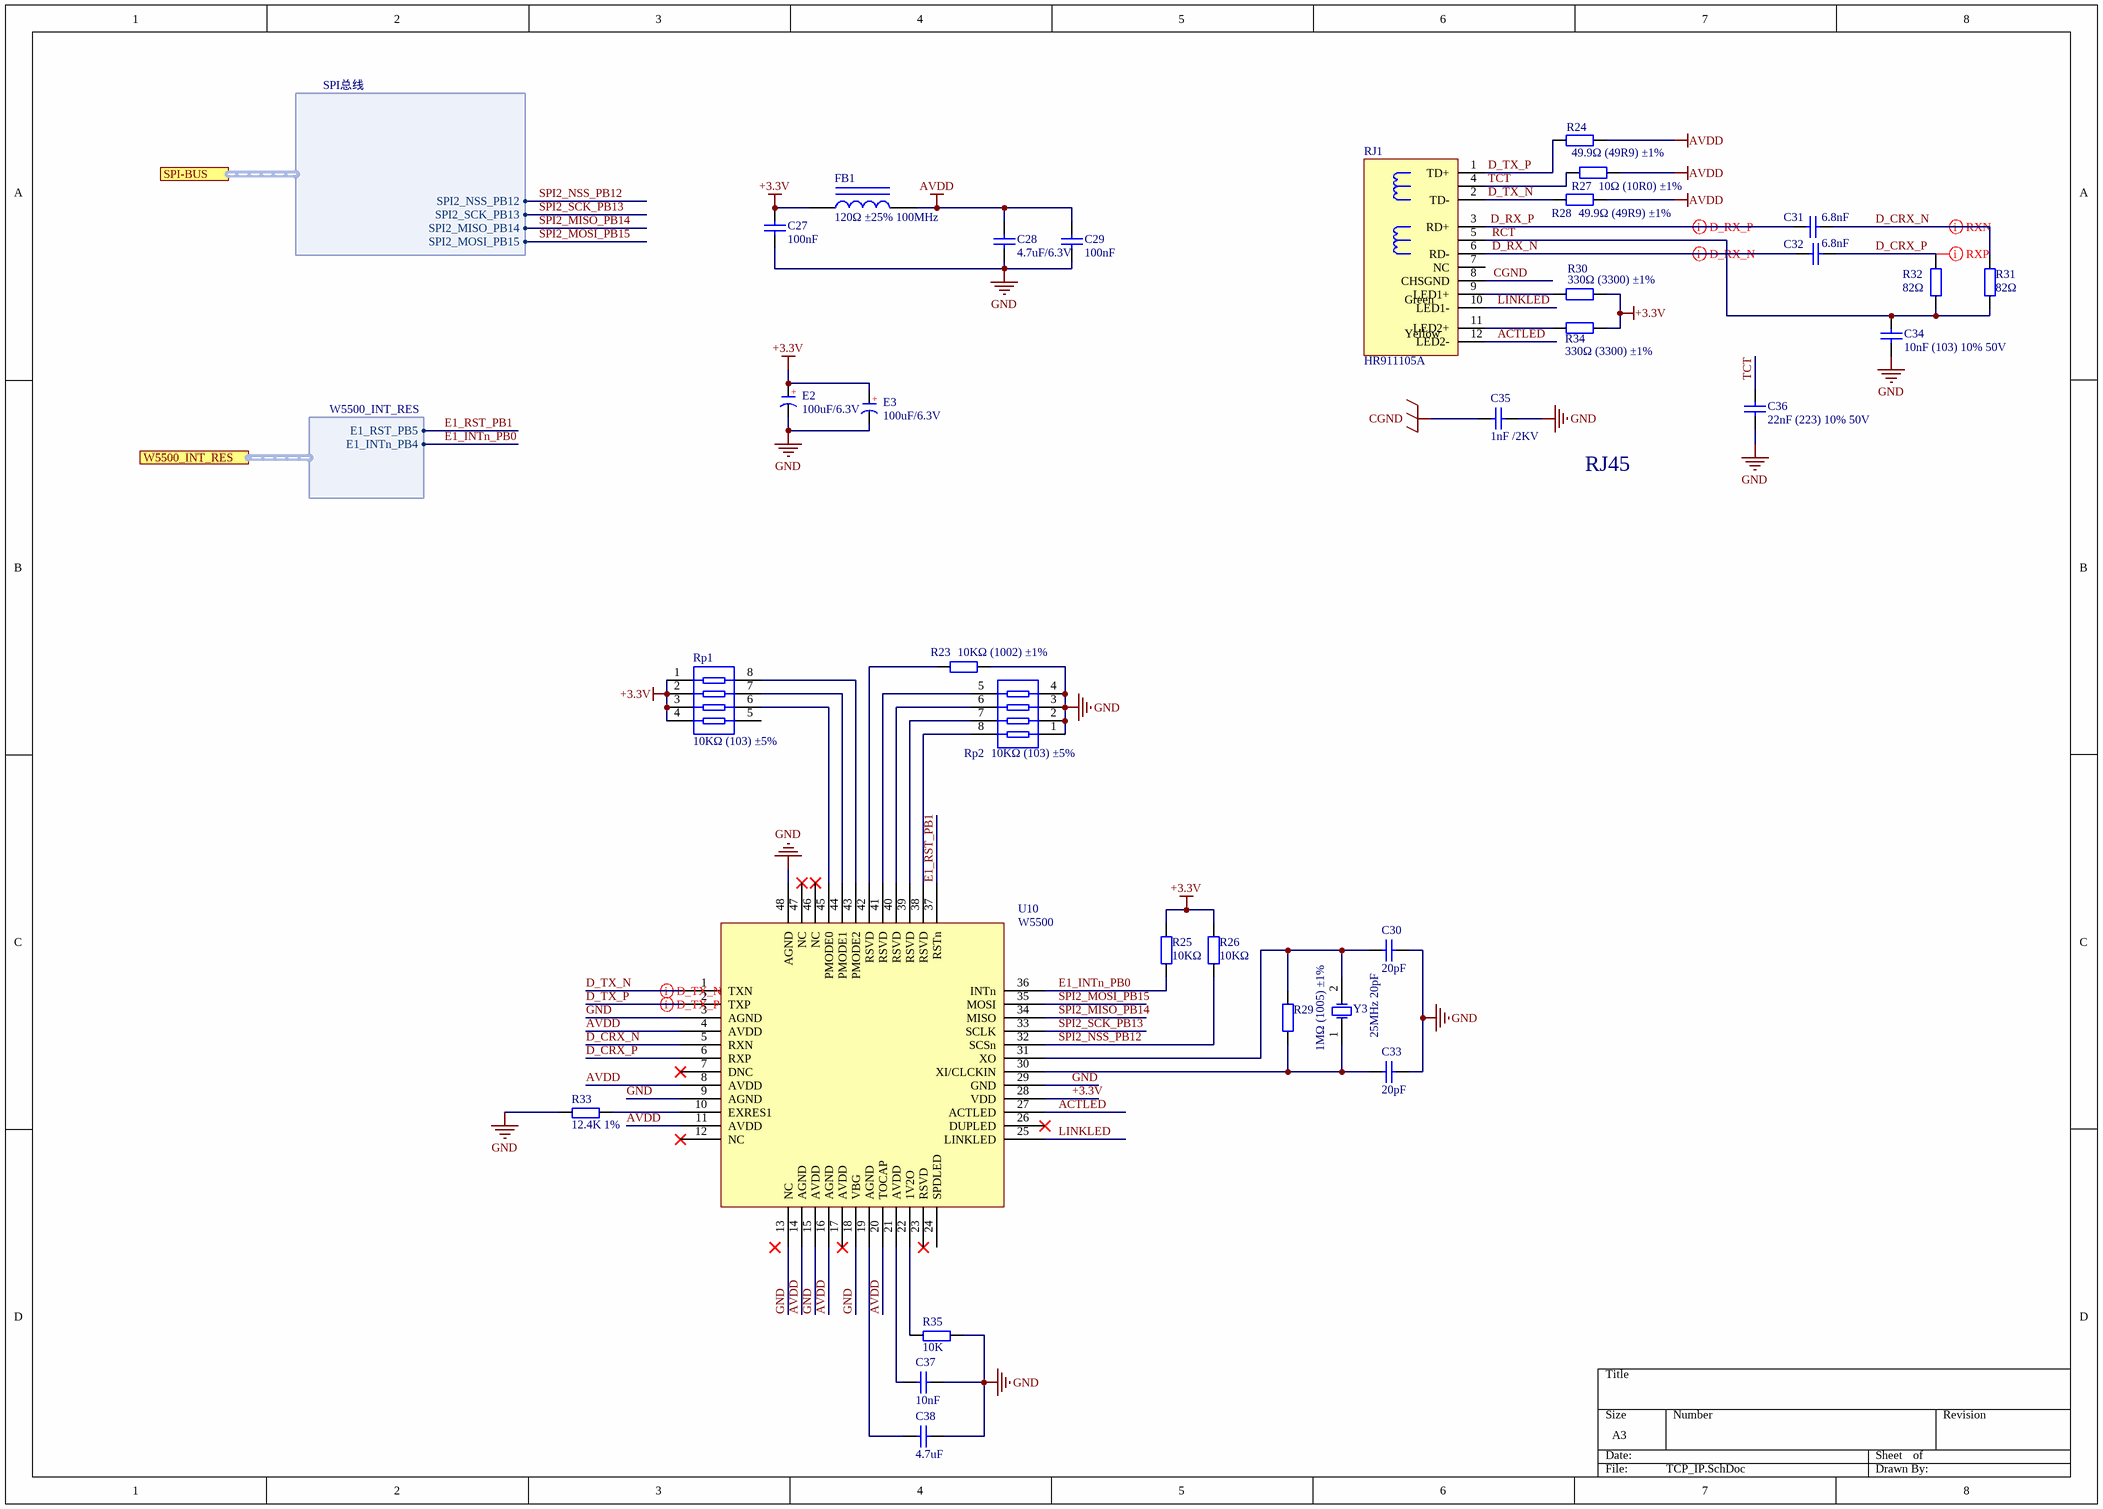
[diagram p4: TCP_IP.SchDoc]

### Parts
C27  100nF  [0603_C]
C28  4.7uF/6.3V  [0603_C]
C29  100nF  [0603_C]
C30  20pF  [0603_C]
C31  6.8nF  [0603_C]
C32  6.8nF  [0603_C]
C33  20pF  [0603_C]
C34  10nF (103) 10% 50V  [0603_C]
C35  1nF /2KV  [1206_C]
C36  22nF (223) 10% 50V  [0603_C]
C37  10nF  [0603_C]
C38  4.7uF  [0603_C]
E2  100uF/6.3V  [CM C(5*5.4)]
E3  100uF/6.3V  [CM C(5*5.4)]
FB1  120Ω ±25% 100MHz  [0805_L]
R23  10KΩ (1002) ±1%  [0603_R]
R24  49.9Ω (49R9) ±1%  [0603_R]
R25  10KΩ  [0603_R]
R26  10KΩ  [0603_R]
R27  10Ω (10R0) ±1%  [0603_R]
R28  49.9Ω (49R9) ±1%  [0603_R]
R29  1MΩ (1005) ±1%  [0603_R]
R30  330Ω (3300) ±1%  [0603_R]
R31  82Ω  [0603_R]
R32  82Ω  [0603_R]
R33  12.4K 1%  [0603_R]
R34  330Ω (3300) ±1%  [0603_R]
R35  10K  [0603_R]
RJ1  HR911105A  [RJ-45A12]
Rp1  10KΩ (103) ±5%  [0603_Rx4]
Rp2  10KΩ (103) ±5%  [0603_Rx4]
U10  W5500  [LQFP-48_7x7x05P]
Y3  25MHz 20pF  [XTAL-49S DIP]

### Ports
SPI-BUS (harness SPI总线), W5500_INT_RES (harness W5500_INT_RES)

### Harnesses
SPI总线: SPI2_NSS_PB12, SPI2_SCK_PB13, SPI2_MISO_PB14, SPI2_MOSI_PB15
W5500_INT_RES: E1_RST_PB5, E1_INTn_PB4

### Nets
+3.3V: C27.2 E2.1(A) E3.1(A) FB1.1 R25.2 R26.2 R30.1 R34.1 Rp1.1 Rp1.2 Rp1.3 Rp1.4 U10.28(VDD)
AVDD: C28.2 C29.2 FB1.2 R24.2 R27.1 R28.2 U10.4(AVDD) U10.8(AVDD) U10.11(AVDD) U10.14(AGND) U10.16(AGND) U10.20(TOCAP)
CGND: C35.1 RJ1.8(CHSGND)
GND: C27.1 C28.1 C29.1 C30.1 C33.1 C34.1 C35.2 C36.1 C37.1 C38.2 E2.2(K) E3.2(K) R23.2 R33.1 R35.2 Rp2.1 Rp2.2 Rp2.3 Rp2.4 U10.3(AGND) U10.9(AGND) U10.13(NC) U10.15(AVDD) U10.18(VBG) U10.29(GND) U10.48(AGND)
ACTLED: RJ1.12(LED2-) U10.27(ACTLED)
D_CRX_N: C31.1 R31.2 U10.5(RXN)
D_CRX_P: C32.1 R32.2 U10.6(RXP)
D_RX_N: C32.2 RJ1.6(RD-)
D_RX_P: C31.2 RJ1.3(RD+)
D_TX_N: R28.1 RJ1.2(TD-) U10.1(TXN)
D_TX_P: R24.1 RJ1.1(TD+) U10.2(TXP)
E1_INTn_PB0: R25.1 U10.36(INTn) ; port W5500_INT_RES.E1_INTn_PB4
E1_RST_PB1: U10.37(RSTn) ; port W5500_INT_RES.E1_RST_PB5
LINKLED: RJ1.10(LED1-) U10.25(LINKLED)
RCT: C34.2 R31.1 R32.1 RJ1.5
SPI2_MISO_PB14: U10.34(MISO) ; port SPI-BUS.SPI2_MISO_PB14
SPI2_MOSI_PB15: U10.35(MOSI) ; port SPI-BUS.SPI2_MOSI_PB15
SPI2_NSS_PB12: R26.1 U10.32(SCSn) ; port SPI-BUS.SPI2_NSS_PB12
SPI2_SCK_PB13: U10.33(SCLK) ; port SPI-BUS.SPI2_SCK_PB13
TCT: C36.2 R27.2 RJ1.4
NetC30_2: C30.2 R29.2 U10.31(XO) Y3.2(OSC2)
NetC33_2: C33.2 R29.1 U10.30(XI/CLCKIN) Y3.1(OSC1)
NetC37_2: C37.2 U10.21(AVDD)
NetC38_1: C38.1 U10.19(AGND)
NetR23_1: R23.1 U10.42(RSVD)
NetR30_2: R30.2 RJ1.9(LED1+)
NetR33_2: R33.2 U10.10(EXRES1)
NetR34_2: R34.2 RJ1.11(LED2+)
NetR35_1: R35.1 U10.22(1V2O)
NetRp1_6: Rp1.6 U10.45(PMODE0)
NetRp1_7: Rp1.7 U10.44(PMODE1)
NetRp1_8: Rp1.8 U10.43(PMODE2)
NetRp2_5: Rp2.5 U10.41(RSVD)
NetRp2_6: Rp2.6 U10.40(RSVD)
NetRp2_7: Rp2.7 U10.39(RSVD)
NetRp2_8: Rp2.8 U10.38(RSVD)

Not connected (* = marked no-connect by the designer): RJ1 7(NC); Rp1 5; U10 7(DNC)* 12(NC)* 17(AVDD)* 23(RSVD)* 24(SPDLED) 26(DUPLED)* 46(NC)* 47(NC)*

### Layout directives
differential pair; net class ERX: D_CRX_N, D_CRX_P, D_RX_N, D_RX_P
differential pair; net class ETX: D_TX_N, D_TX_P

### Notes on the sheet
- RJ45
- (in symbol C-CM) +
- (in symbol HR911105A) Green; Yellow

### Library data of the parts
C27-C29 = 0603 100nF (104) 10% 50V: 贴片电容; ComponentLink1Description: 供应商链接; ComponentLink1URL: http://www.szlcsc.com/product/details_15331.html; Package: 0603; Supplier: LC; SuppliersPartNumber: C14663
C30 C33 = 0603 6pF (6R0) 0.25pF 50V: 贴片电容; ComponentLink1Description: 供应商链接; ComponentLink1URL: http://www.szlcsc.com/product/details_38453.html; Package: 0603; Supplier: LC; SuppliersPartNumber: C37474
C31 C32 = 0603 6.8nF (682) 10% 50V: 贴片电容; ComponentLink1Description: 供应商链接; ComponentLink1URL: http://www.szlcsc.com/product/details_1983.html; Package: 0603; Supplier: LC; SuppliersPartNumber: C1631
C34 C37 = 0603 10nF (103) 10% 50V: 贴片电容; ComponentLink1Description: 供应商链接; ComponentLink1URL: http://www.szlcsc.com/product/details_58143.html; Package: 0603; Supplier: LC; SuppliersPartNumber: C57112
C35 = 1206 470pF (471) 10% 50V: 贴片电容; ComponentLink1Description: 供应商链接; ComponentLink1URL: http://www.szlcsc.com/product/details_2220.html; Package: 1206; Supplier: LC; SuppliersPartNumber: C1868
C36 = 0603 22nF (223) 10% 50V: 贴片电容; ComponentLink1Description: 供应商链接; ComponentLink1URL: http://www.szlcsc.com/product/details_21834.html; Package: 0603; Supplier: LC; SuppliersPartNumber: C21122
C38 = 0603 4.7uF (475) 10% 16V: 贴片电容; ComponentLink1Description: 供应商链接; ComponentLink1URL: http://www.szlcsc.com/product/details_20375.html; Package: 0603; Supplier: LC; SuppliersPartNumber: C19666
E2 E3 = C-CM: 贴片电解电容; 版权归属: 源创客; BOM名称: 贴片电解电容; 学习资源: www.ooocke.com
FB1 = 0805 600Ω 25% 100MHz: 贴片磁珠; ComponentLink1Description: 供应商链接; ComponentLink1URL: http://www.szlcsc.com/product/details_1369.html; Package: 0805; Supplier: LC; SuppliersPartNumber: C1017
R23 R25 R26 = 0603 10KΩ (1002) 1%: 贴片电阻; ComponentLink1Description: 供应商链接; ComponentLink1URL: http://www.szlcsc.com/product/details_26547.html; Package: 0603; Supplier: LC; SuppliersPartNumber: C25804
R24 R28 = 0603 49.9Ω (49R9) 1%: 贴片电阻; ComponentLink1Description: 供应商链接; ComponentLink1URL: http://www.szlcsc.com/product/details_23912.html; Package: 0603; Supplier: LC; SuppliersPartNumber: C23185
R27 = 0603 10Ω (10R0) 1%: 贴片电阻; ComponentLink1Description: 供应商链接; ComponentLink1URL: http://www.szlcsc.com/product/details_23586.html; Package: 0603; Supplier: LC; SuppliersPartNumber: C22859
R29 = 0603 10MΩ (1005) 1%: 贴片电阻; ComponentLink1Description: 供应商链接; ComponentLink1URL: http://www.szlcsc.com/product/details_7726.html; Package: 0603; Supplier: LC; SuppliersPartNumber: C7250
R30 R34 = 0603 330Ω (3300) 1%: 贴片电阻; ComponentLink1Description: 供应商链接; ComponentLink1URL: http://www.szlcsc.com/product/details_23865.html; Package: 0603; Supplier: LC; SuppliersPartNumber: C23138
R31 R32 = 0603 82Ω (82R0) 1%: 贴片电阻; ComponentLink1Description: 供应商链接; ComponentLink1URL: http://www.szlcsc.com/product/details_23982.html; Package: 0603; Supplier: LC; SuppliersPartNumber: C23255
R33 R35 = R
RJ1 = HR911105A: 带灯以太网接口; 版权归属: 源创客; BOM名称: 带灯以太网接口; 学习资源: www.ooocke.com
Rp1 Rp2 = 0603*4  10KΩ (103) 5%: 贴片排阻; ComponentLink1Description: 供应商链接; ComponentLink1URL: http://www.szlcsc.com/product/details_30472.html; Package: 0603*4; Supplier: LC; SuppliersPartNumber: C29718
U10 = W5500: 以太网; ComponentLink1Description: 供应商链接; ComponentLink1URL: http://www.szlcsc.com/product/details_33808.html; Package: LQFP-48_7x7x05P; Supplier: LC; SuppliersPartNumber: C32843
Y3 = SMD-5032_2P 8MHz 20ppm 20pF: 贴片晶振; ComponentLink1Description: 供应商链接; ComponentLink1URL: http://www.szlcsc.com/product/details_19261.html; Package: SMD-5032_2P; Supplier: LC; SuppliersPartNumber: C18560

## Sheet 继电器.SchDoc
size A3
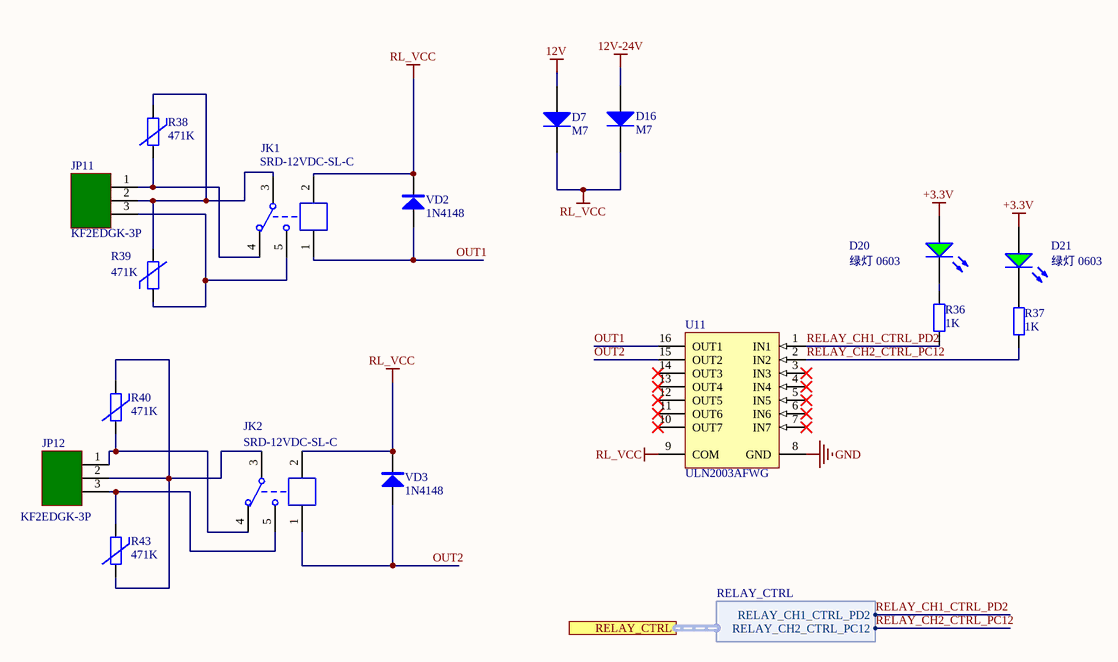
[diagram p5: 继电器.SchDoc]

### Parts
D7  M7  [SMA(DO-214AC)_S1]
D16  M7  [SMA(DO-214AC)_S1]
D20  绿灯 0603  [0603_LED_S1]
D21  绿灯 0603  [0603_LED_S1]
JK1  SRD-12VDC-SL-C  [SRD-C_B]
JK2  SRD-12VDC-SL-C  [SRD-C_B]
JP11  KF2EDGK-3P  [KF2EDGK5.08W-3P]
JP12  KF2EDGK-3P  [KF2EDGK5.08W-3P]
R36  1K  [0603_R]
R37  1K  [0603_R]
R38  471K  [VDR 9D-4.5]
R39  471K  [VDR 9D-4.5]
R40  471K  [VDR 9D-4.5]
R43  471K  [VDR 9D-4.5]
U11  ULN2003AFWG  [SOIC-16_150mil]
VD2  1N4148  [MINI_MELF (LL34)]
VD3  1N4148  [MINI_MELF (LL34)]

### Ports
RELAY_CTRL (harness RELAY_CTRL)

### Harnesses
RELAY_CTRL: RELAY_CH1_CTRL_PD2, RELAY_CH2_CTRL_PC12

### Nets
12V: D7.1(A)
12V-24V: D16.1(A)
+3.3V: D20.A D21.A
GND: U11.8(GND)
RL_VCC: D7.2(K) D16.2(K) JK1.2 JK2.2 U11.9(COM) VD2.2(K) VD3.2(K)
OUT1: JK1.1 U11.16(OUT1) VD2.1(A)
OUT2: JK2.1 U11.15(OUT2) VD3.1(A)
RELAY_CH1_CTRL_PD2: R36.1 U11.1(IN1) ; port RELAY_CTRL.RELAY_CH1_CTRL_PD2
RELAY_CH2_CTRL_PC12: R37.1 U11.2(IN2) ; port RELAY_CTRL.RELAY_CH2_CTRL_PC12
NetD20_K: D20.K R36.2
NetD21_K: D21.K R37.2
NetJK1_3: JK1.3 JP11.2 R38.1 R39.2
NetJK1_4: JK1.4 JP11.1 R38.2
NetJK1_5: JK1.5 JP11.3 R39.1
NetJK2_3: JK2.3 JP12.2 R40.1 R43.2
NetJK2_4: JK2.4 JP12.1 R40.2
NetJK2_5: JK2.5 JP12.3 R43.1

Not connected (* = marked no-connect by the designer): U11 3(IN3)* 4(IN4)* 5(IN5)* 6(IN6)* 7(IN7)* 10(OUT7)* 11(OUT6)* 12(OUT5)* 13(OUT4)* 14(OUT3)*

### Library data of the parts
D7 D16 = SMA(DO-214AC) M7: as D18 on sheet 电源; ComponentLink1Description: 供应商链接; ComponentLink1URL: http://www.szlcsc.com/product/details_2841.html; Package: SMA(DO-214AC); Supplier: LC; SuppliersPartNumber: C95872
D20 D21 = 0603 绿灯: 发光二极管; ComponentLink1Description: 供应商链接; ComponentLink1URL: http://www.szlcsc.com/product/details_73152.html; Package: 0603; Supplier: LC; SuppliersPartNumber: C72043
JK1 JK2 = SRD-12VDC-SL-C: 12V单路双控继电器; BOM名称: 12V继电器; 版权归属: 源创客; 学习资源: www.ooocke.com
R36 R37 = 0603 510Ω (5100) 1%: 贴片电阻; ComponentLink1Description: 供应商链接; ComponentLink1URL: http://www.szlcsc.com/product/details_23920.html; Package: 0603; Supplier: LC; SuppliersPartNumber: C23193
R38-R40 R43 = R_VDR: 压敏电阻; 版权归属: 源创客; BOM名称: 压敏电阻; 学习资源: www.ooocke.com
U11 = ULN2003AFWG: 大电流驱动; ComponentLink1Description: 供应商链接; ComponentLink1URL: http://www.szlcsc.com/product/details_5880.html; Package: SOIC-16_150mil; Supplier: LC; SuppliersPartNumber: C5437
VD2 VD3 = 1N4148: 高速开关二极管; 版权归属: 源创客; BOM名称: 高速开关二极管; 学习资源: www.ooocke.com

## Sheet 开关量输入.SchDoc
size A3
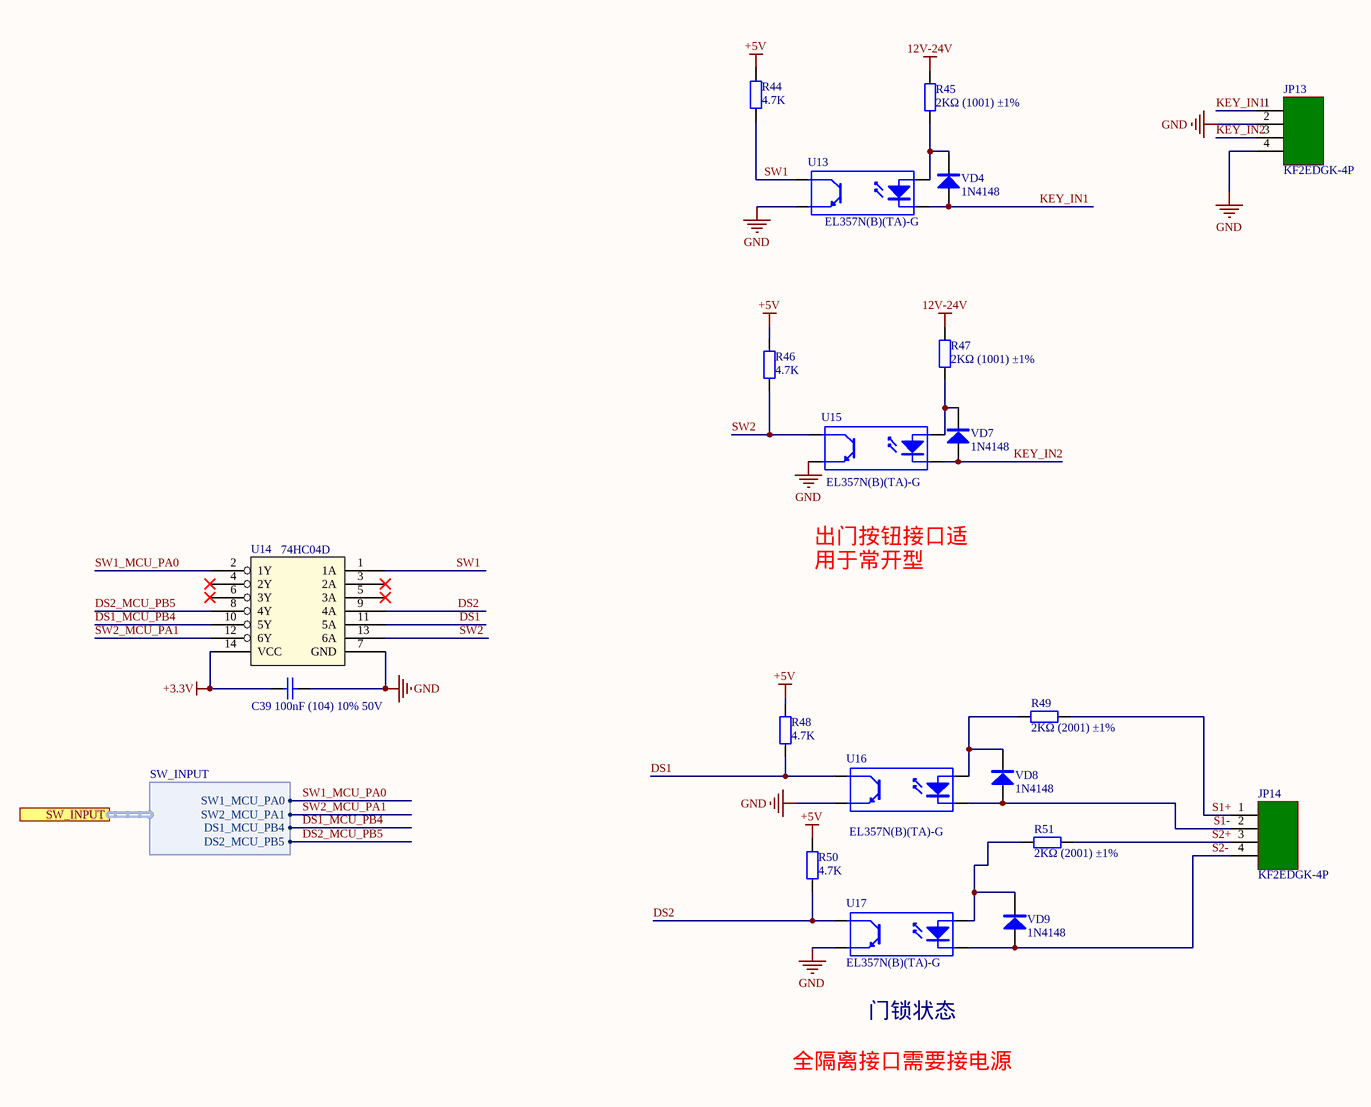
[diagram p6: 开关量输入.SchDoc]

### Parts
C39  100nF (104) 10% 50V  [0603_C]
JP13  KF2EDGK-4P  [KF2EDGK5.08W-4P]
JP14  KF2EDGK-4P  [KF2EDGK5.08W-4P]
R44  4.7K  [0603_R]
R45  2KΩ (1001) ±1%  [0603_R]
R46  4.7K  [0603_R]
R47  2KΩ (1001) ±1%  [0603_R]
R48  4.7K  [0603_R]
R49  2KΩ (2001) ±1%  [0805_R]
R50  4.7K  [0603_R]
R51  2KΩ (2001) ±1%  [0805_R]
U13  EL357N(B)(TA)-G  [SOP-4_P2.54]
U14  74HC04D  [SOIC-14_150mil]
U15  EL357N(B)(TA)-G  [SOP-4_P2.54]
U16  EL357N(B)(TA)-G  [SOP-4_P2.54]
U17  EL357N(B)(TA)-G  [SOP-4_P2.54]
VD4  1N4148  [MINI_MELF (LL34)]
VD7  1N4148  [MINI_MELF (LL34)]
VD8  1N4148  [MINI_MELF (LL34)]
VD9  1N4148  [MINI_MELF (LL34)]

### Ports
SW_INPUT (harness SW_INPUT)

### Harnesses
SW_INPUT: SW1_MCU_PA0, SW2_MCU_PA1, DS1_MCU_PB4, DS2_MCU_PB5

### Nets
12V-24V: R45.2 R47.2
+3.3V: C39.1 U14.14(VCC)
+5V: R44.2 R46.2 R48.2 R50.2
GND: C39.2 JP13.2 JP13.4 U13.3(E) U14.7(GND) U15.3(E) U16.3(E) U17.3(E)
DS1: R48.1 U14.11(5A) U16.4(C)
DS1_MCU_PB4: U14.10(5Y) ; port SW_INPUT.DS1_MCU_PB4
DS2: R50.1 U14.9(4A) U17.4(C)
DS2_MCU_PB5: U14.8(4Y) ; port SW_INPUT.DS2_MCU_PB5
KEY_IN1: JP13.1 U13.2(K) VD4.1(A)
KEY_IN2: JP13.3 U15.2(K) VD7.1(A)
S1+: JP14.1 R49.2
S1-: JP14.2 U16.2(K) VD8.1(A)
S2+: JP14.3 R51.2
S2-: JP14.4 U17.2(K) VD9.1(A)
SW1: R44.1 U13.4(C) U14.1(1A)
SW1_MCU_PA0: U14.2(1Y) ; port SW_INPUT.SW1_MCU_PA0
SW2: R46.1 U14.13(6A) U15.4(C)
SW2_MCU_PA1: U14.12(6Y) ; port SW_INPUT.SW2_MCU_PA1
NetR45_1: R45.1 U13.1(A) VD4.2(K)
NetR47_1: R47.1 U15.1(A) VD7.2(K)
NetR49_1: R49.1 U16.1(A) VD8.2(K)
NetR51_1: R51.1 U17.1(A) VD9.2(K)

Not connected (* = marked no-connect by the designer): U14 3(2A)* 4(2Y)* 5(3A)* 6(3Y)*

### Notes on the sheet
- 出门按钮接口适用于常开型
- (near U17) 门锁状态
- 全隔离接口需要接电源

### Library data of the parts
C39 = 0603 100nF (104) 10% 50V: 贴片电容; ComponentLink1Description: 供应商链接; ComponentLink1URL: http://www.szlcsc.com/product/details_15331.html; Package: 0603; Supplier: LC; SuppliersPartNumber: C14663
R44-R48 R50 = 0603 1KΩ (1001) 1%: 贴片电阻; ComponentLink1Description: 供应商链接; ComponentLink1URL: http://www.szlcsc.com/product/details_21904.html; Package: 0603; Supplier: LC; SuppliersPartNumber: C21190
R49 R51 = 0805 2KΩ (2001) 1%: 贴片电阻; ComponentLink1Description: 供应商链接; ComponentLink1URL: http://www.szlcsc.com/product/details_18292.html; Package: 0805; Supplier: LC; SuppliersPartNumber: C17604
U13 U15-U17 = EL357N(B)(TA)-G: 贴片光耦; ComponentLink1Description: 供应商链接; ComponentLink1URL: http://www.szlcsc.com/product/details_7114.html; Package: SOP-4_P2.54; Supplier: LC; SuppliersPartNumber: C6649
U14 = 74HC04D: 反相器; ComponentLink1Description: 供应商; ComponentLink1URL: https://item.szlcsc.com/87790.html
VD4 VD7-VD9 = 1N4148: 高速开关二极管; 版权归属: 源创客; BOM名称: 高速开关二极管; 学习资源: www.ooocke.com

## Sheet 韦根输入输出.SchDoc
size A3
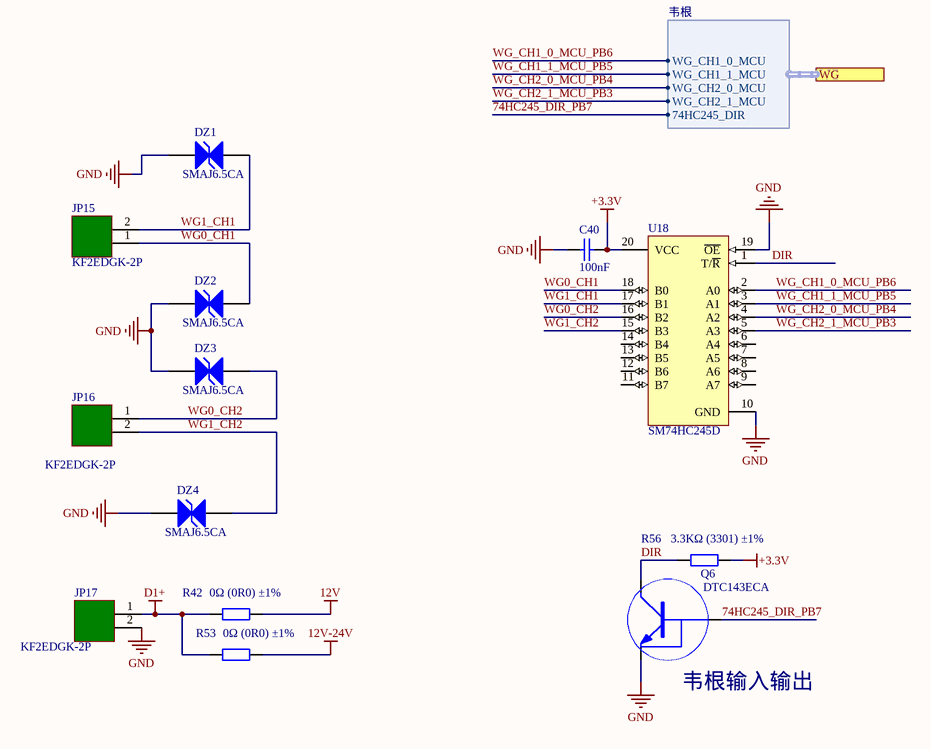
[diagram p7: 韦根输入输出.SchDoc]

### Parts
C40  100nF  [0603_C]
DZ1  SMAJ6.5CA  [LC-SMA(DO-214AC)_S1]
DZ2  SMAJ6.5CA  [LC-SMA(DO-214AC)_S1]
DZ3  SMAJ6.5CA  [LC-SMA(DO-214AC)_S1]
DZ4  SMAJ6.5CA  [LC-SMA(DO-214AC)_S1]
JP15  KF2EDGK-2P  [KF2EDGK5.08W-2P]
JP16  KF2EDGK-2P  [KF2EDGK5.08W-2P]
JP17  KF2EDGK-2P  [KF2EDGK5.08W-2P]
Q6  DTC143ECA
R42  0Ω (0R0) ±1%  [1206_R]
R53  0Ω (0R0) ±1%  [1206_R]
R56  3.3KΩ (3301) ±1%  [0603_R]
U18  SM74HC245D  [SOIC-20_300mil]

### Ports
WG (harness 韦根)

### Harnesses
韦根: WG_CH1_0_MCU, WG_CH1_1_MCU, WG_CH2_0_MCU, WG_CH2_1_MCU, 74HC245_DIR

### Nets
12V: R42.2
12V-24V: R53.2
+3.3V: C40.1 R56.2 U18.20(VCC)
D1+: JP17.1 R42.1 R53.1
GND: C40.2 DZ1.1(A) DZ2.1(A) DZ3.1(A) DZ4.1(A) JP17.2 Q6.2(GND) U18.10(GND) U18.19(~{OE})
74HC245_DIR_PB7: Q6.1(IN) ; port WG.74HC245_DIR
DIR: Q6.3(OUT) R56.1 U18.1(T/~{R})
WG0_CH1: DZ2.2(K) JP15.1 U18.18(B0)
WG0_CH2: DZ3.2(K) JP16.1 U18.16(B2)
WG1_CH1: DZ1.2(K) JP15.2 U18.17(B1)
WG1_CH2: DZ4.2(K) JP16.2 U18.15(B3)
WG_CH1_0_MCU_PB6: U18.2(A0) ; port WG.WG_CH1_0_MCU
WG_CH1_1_MCU_PB5: U18.3(A1) ; port WG.WG_CH1_1_MCU
WG_CH2_0_MCU_PB4: U18.4(A2) ; port WG.WG_CH2_0_MCU
WG_CH2_1_MCU_PB3: U18.5(A3) ; port WG.WG_CH2_1_MCU

Not connected (* = marked no-connect by the designer): U18 6(A4) 7(A5) 8(A6) 9(A7) 11(B7) 12(B6) 13(B5) 14(B4)

### Notes on the sheet
- (near Q6) 韦根输入输出

### Library data of the parts
C40 = 0603 100nF (104) 10% 50V: 贴片电容; ComponentLink1Description: 供应商链接; ComponentLink1URL: http://www.szlcsc.com/product/details_15331.html; Package: 0603; Supplier: LC; SuppliersPartNumber: C14663
DZ1-DZ4 = SMB/DO-214AA P6SMB6.8CA: TVS; ComponentLink1Description: 供应商链接; ComponentLink1URL: http://www.szlcsc.com/product/details_79530.html; Package: SMB/DO-214AA; Supplier: LC; SuppliersPartNumber: C78395
Q6 = DTC143ECA: NPN集成三极管
R42 R53 = 1206 0Ω (0R0) 1%: 贴片电阻; ComponentLink1Description: 供应商链接; ComponentLink1URL: http://www.szlcsc.com/product/details_18576.html; Package: 1206; Supplier: LC; SuppliersPartNumber: C17888
R56 = 0603 3.3KΩ (3301) 1%: 贴片电阻; ComponentLink1Description: 供应商链接; ComponentLink1URL: http://www.szlcsc.com/product/details_23705.html; Package: 0603; Supplier: LC; SuppliersPartNumber: C22978
U18 = 74HC245D: 74系列逻辑芯片; ComponentLink1Description: 供应商链接; ComponentLink1URL: http://www.szlcsc.com/product/details_6076.html; Package: SOIC-20_300mil; Supplier: LC; SuppliersPartNumber: C5625

## Nets that join several sheets
12V: 485 (R55.1), 电源 (C42.1 C44.2 L2.2 U9.3), 继电器 (D7.1), 韦根输入输出 (R42.2)
12V-24V: 485 (R57.1), 电源 (8 pins), 继电器 (D16.1), 开关量输入 (R45.2 R47.2), 韦根输入输出 (R53.2)
+3.3V: 主控 (26 pins), 电源 (E1.1 V1.2), TCP_IP (13 pins), 继电器 (D20.A D21.A), 开关量输入 (C39.1 U14.14), 韦根输入输出 (C40.1 R56.2 U18.20)
+5V: 主控 (J9.2 JP10.1 VD1.2), 485 (9 pins), 电源 (6 pins), 开关量输入 (R44.2 R46.2 R48.2 R50.2)
GND: 主控 (38 pins), 485 (11 pins), 电源 (28 pins), TCP_IP (26 pins), 继电器 (U11.8), 开关量输入 (8 pins), 韦根输入输出 (9 pins)
74HC245_DIR_PB7: 主控 (U5.59), 韦根输入输出 (Q6.1)
485_CTRL_CH1_PA1: 主控 (U5.15), 485 (U1.2 U1.3)
485_CTRL_CH2_PA0: 主控 (U5.14), 485 (U3.2 U3.3)
485_CTRL_CH3_PC15: 主控 (U5.4), 485 (U4.2 U4.3)
485CH1_USART2_RX_PA3: 主控 (U5.17), 485 (U3.1)
485CH1_USART2_TX_PA2: 主控 (U5.16), 485 (U3.4)
485CH2_UART4_RX_PC11: 主控 (U5.52), 485 (U4.1)
485CH2_UART4_TX_PC10: 主控 (U5.51), 485 (U4.4)
485CH2_USART3_TX_PB10: 主控 (U5.29), 485 (U1.4)
485CH3_USART3_RX_PB11: 主控 (U5.30), 485 (U1.1)
DS1_MCU_PB4: 主控 (U5.39), 开关量输入 (U14.10)
DS2_MCU_PB5: 主控 (U5.40), 开关量输入 (U14.8)
E1_INTn_PB0: 主控 (U5.26), TCP_IP (R25.1 U10.36)
E1_RST_PB1: 主控 (U5.27), TCP_IP (U10.37)
RELAY_CH1_CTRL_PD2: 主控 (U5.54), 继电器 (R36.1 U11.1)
RELAY_CH2_CTRL_PC12: 主控 (U5.53), 继电器 (R37.1 U11.2)
SPI2_MISO_PB14: 主控 (U5.35), TCP_IP (U10.34)
SPI2_MOSI_PB15: 主控 (U5.36), TCP_IP (U10.35)
SPI2_NSS_PB12: 主控 (U5.33), TCP_IP (R26.1 U10.32)
SPI2_SCK_PB13: 主控 (U5.34), TCP_IP (U10.33)
SW1_MCU_PA0: 主控 (U5.37), 开关量输入 (U14.2)
SW2_MCU_PA1: 主控 (U5.38), 开关量输入 (U14.12)
WG_CH1_0_MCU_PB6: 主控 (U5.58), 韦根输入输出 (U18.2)
WG_CH1_1_MCU_PB5: 主控 (U5.57), 韦根输入输出 (U18.3)
WG_CH2_0_MCU_PB4: 主控 (U5.56), 韦根输入输出 (U18.4)
WG_CH2_1_MCU_PB3: 主控 (U5.55), 韦根输入输出 (U18.5)